# Altium schematic sheet WL-CONNECT.SchDoc
size 420 x 297 mm; Address1: Address1; Address2: Address2; Address3: Address3; Address4: Address4; DocumentNumber: Wolf-Lite; SheetNumber: 12; Scale: 1:1; DocumentType: Схема электрическая принципиальная; FirstReferrence: АБВГ.123456.001
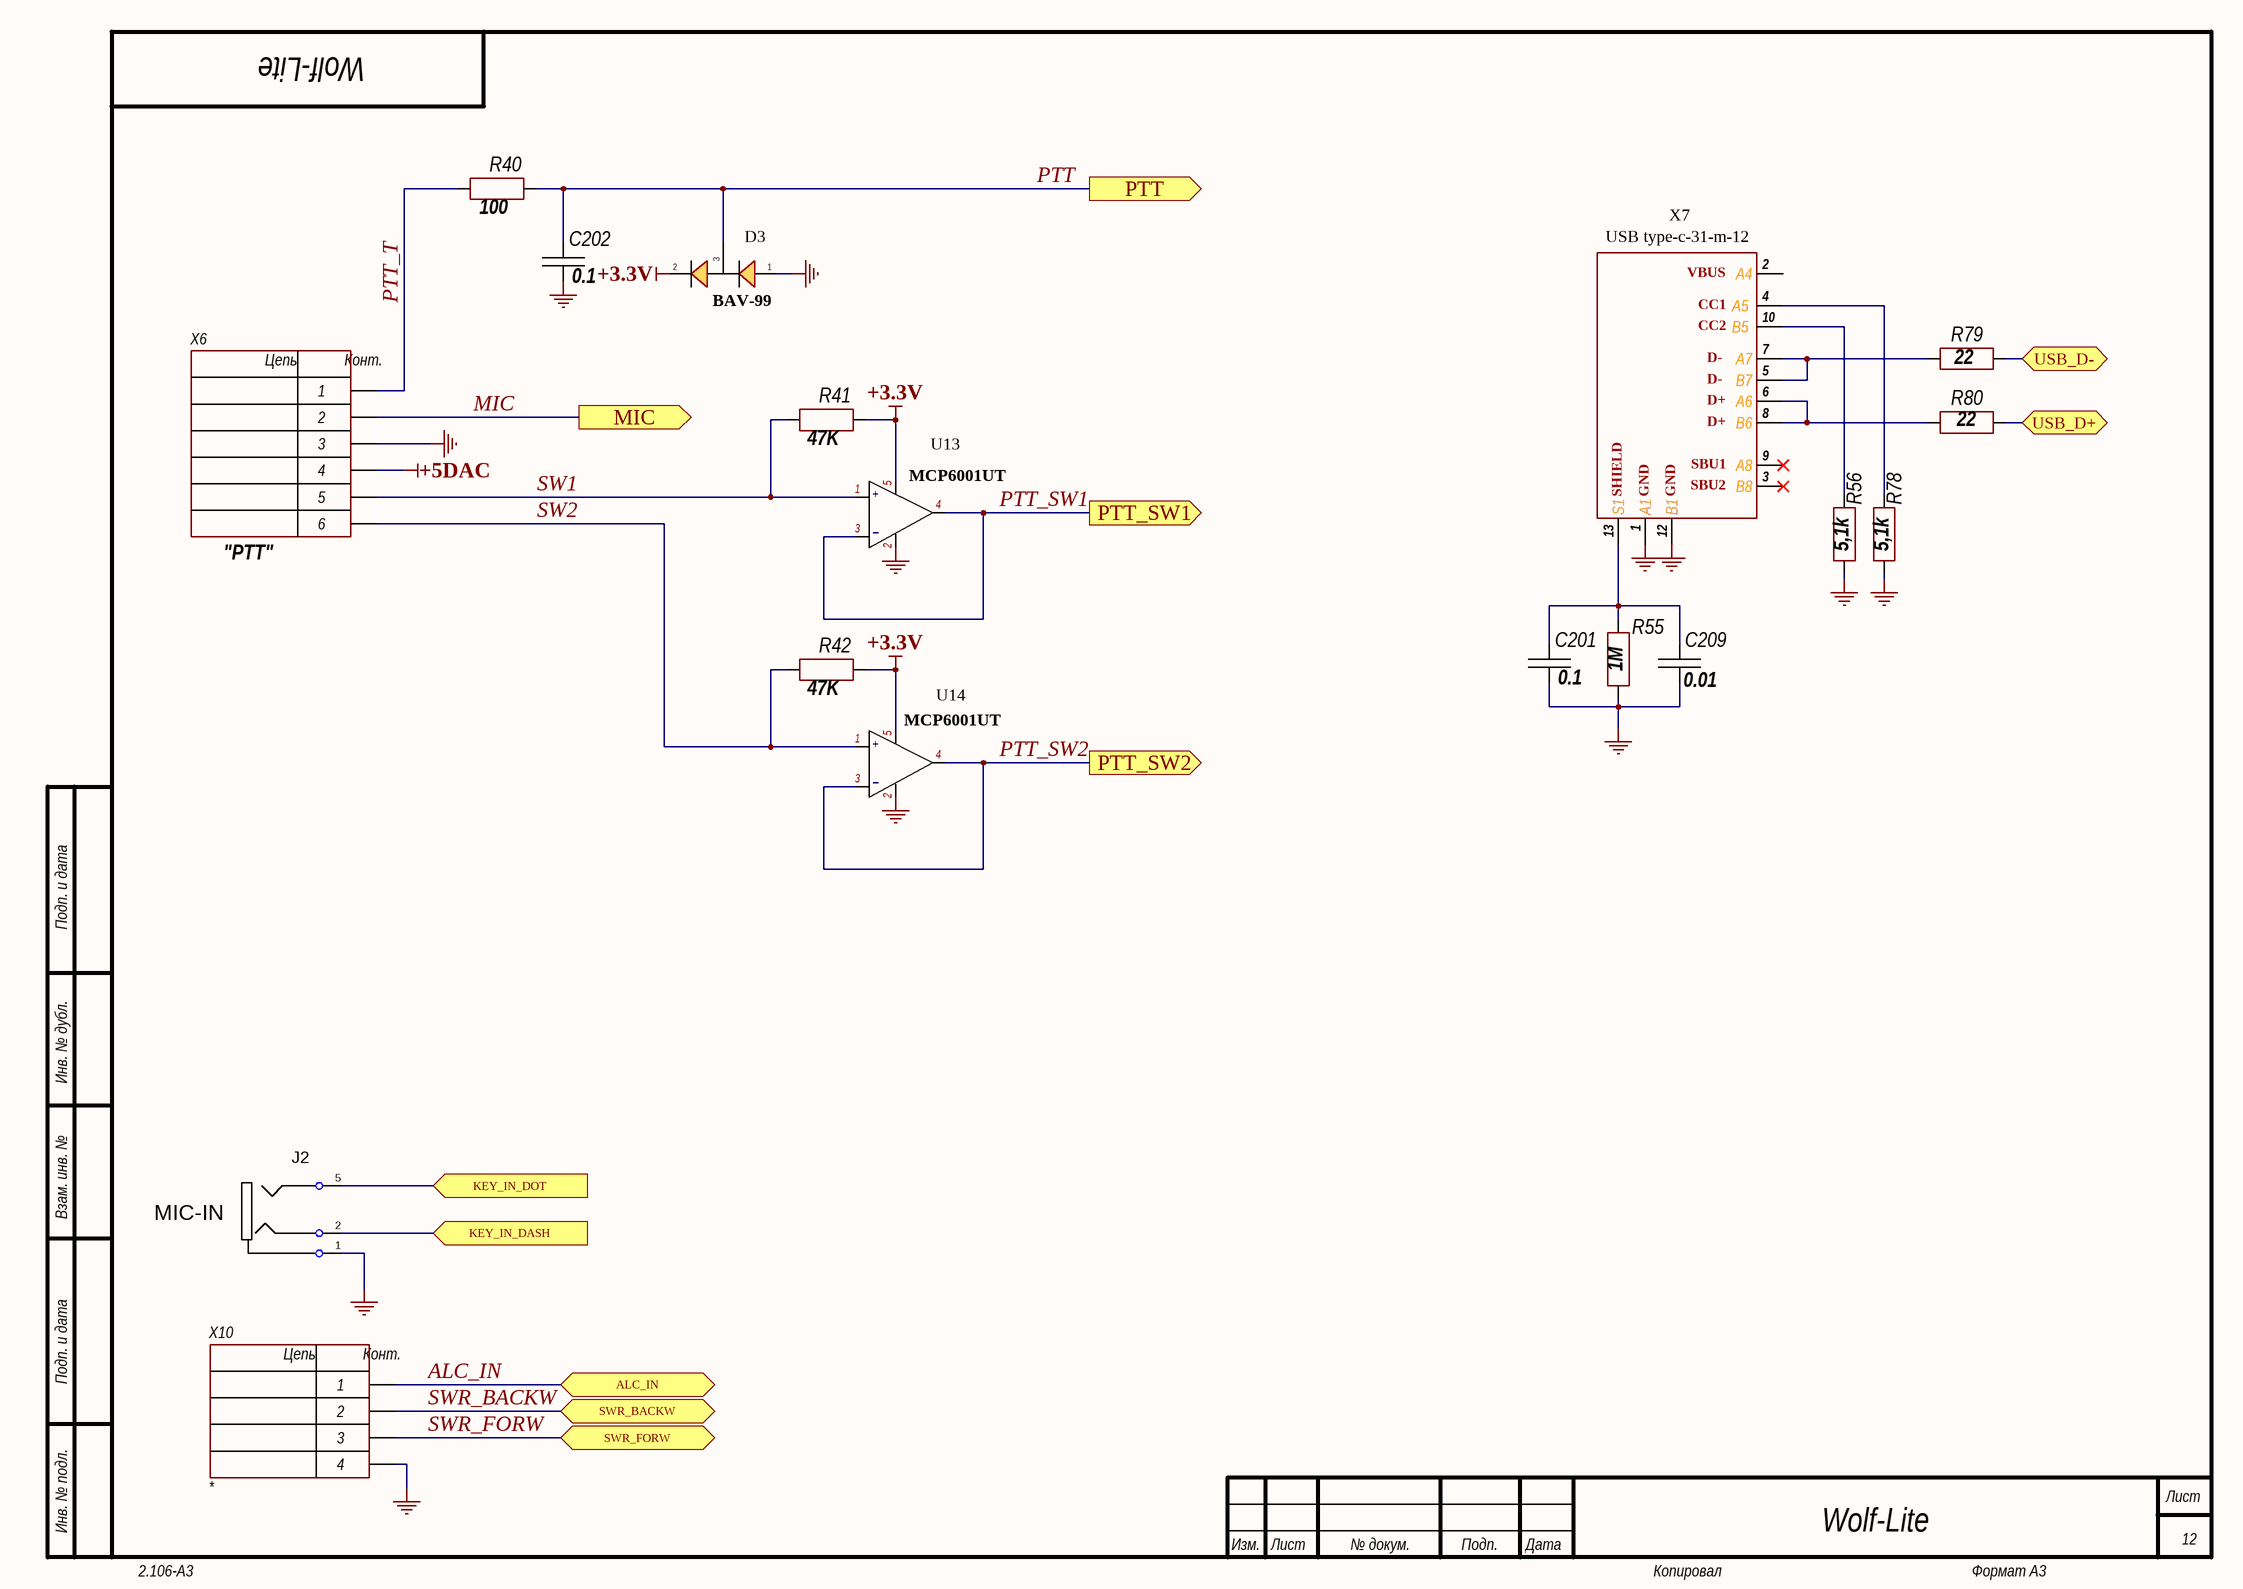
[diagram p0: WL-CONNECT.SchDoc]

## Parts
C201  0.1  [CH0805C]
C202  0.1  [CH0805C]
C209  0.01  [CH0805C]
D3  BAV-99  [SOT23_132]
J2  value MIC-IN  [3.5-stereo]  (hidden comment: SJ1-3525NG)
R40  100  [CH0805R]
R41  47K  [CH0805R]
R42  47K  [CH0805R]
R55  1M  [CH0805R]
R56  5,1k  [CH0805R]
R78  5,1k  [CH0805R]
R79  22  [CH0805R]
R80  22  [CH0805R]
U13  MCP6001UT  [SOT23-5]
U14  MCP6001UT  [SOT23-5]
X6  "PTT"  [RJ25-6pin]
X7  USB type-c-31-m-12  [TYPE-C-31-M-12_V1]
X10  *  [CON: PLS-4]

## Ports
ALC_IN (bidir), KEY_IN_DASH (in), KEY_IN_DOT (in), MIC (out), PTT (out), PTT_SW1 (out), PTT_SW2 (out), SWR_BACKW (bidir), SWR_FORW (bidir), USB_D+ (bidir), USB_D- (bidir)

## Nets
+3.3V: D3.2 R41.2 R42.2 U13.5 U14.5
+5DAC: X6.4
GND: C201.1 C202.1 C209.1 D3.1 J2.1 R55.1 R56.1 R78.1 U13.2 U14.2 X6.3 X7.1(A1) X7.12(B1) X10.4
ALC_IN: X10.1 ; port ALC_IN
KEY_IN_DASH: J2.2 ; port KEY_IN_DASH
KEY_IN_DOT: J2.5 ; port KEY_IN_DOT
MIC: X6.2 ; port MIC
PTT: C202.2 D3.3 R40.2 ; port PTT
PTT_SW1: U13.3 U13.4 ; port PTT_SW1
PTT_SW2: U14.3 U14.4 ; port PTT_SW2
PTT_T: R40.1 X6.1
SW1: R41.1 U13.1 X6.5
SW2: R42.1 U14.1 X6.6
SWR_BACKW: X10.2 ; port SWR_BACKW
SWR_FORW: X10.3 ; port SWR_FORW
USB_D+: R80.2 ; port USB_D+
USB_D-: R79.2 ; port USB_D-
NetC201_2: C201.2 C209.2 R55.2 X7.13(S1)
NetR56_2: R56.2 X7.10(B5)
NetR78_2: R78.2 X7.4(A5)
NetR79_1: R79.1 X7.5(B7) X7.7(A7)
NetR80_1: R80.1 X7.6(A6) X7.8(B6)

Not connected (* = marked no-connect by the designer): X7 2(A4) 3(B8)* 9(A8)*

## Notes on the sheet
- Подп. и дата
- Инв. № дубл.
- Взам. инв. №
- Инв. № подл.
- Изм.
- Лист
- № докум.
- Подп.
- Дата
- 2.106-A3
- Копировал
- Формат А3
- (in symbol 4-Connector) Цепь; Конт.
- (in symbol 6-Connector) Цепь; Конт.
- (in symbol MCP6001UT_1) +; -
- (in symbol USB-C_2.0) VBUS; CC1; CC2; D-; D+; SBU1; SHIELD; GND; SBU2

## Library data of the parts
C201 C202 C209 = Capacitor: Manufacturer: *; Model: *; HelpURL: *; ComponentKind: *; Value: *
J2 = SJ1-3523N
R40-R42 R55 R56 R78-R80 = Resistor: Manufacturer: *; Model: *; HelpURL: *; ComponentKind: *; Value: *
U13 U14 = MCP6001UT_1
X6 = 6-Connector: Model: *; Manufacturer: *; HelpURL: *; ComponentKind: *
X7 = USB-C_2.0
X10 = 4-Connector: Model: *; Manufacturer: *; HelpURL: *; ComponentKind: *